# Altium schematic sheet Decimal Display Electronic Scheme_2021-10-08.schdoc
size 402 x 191 mm
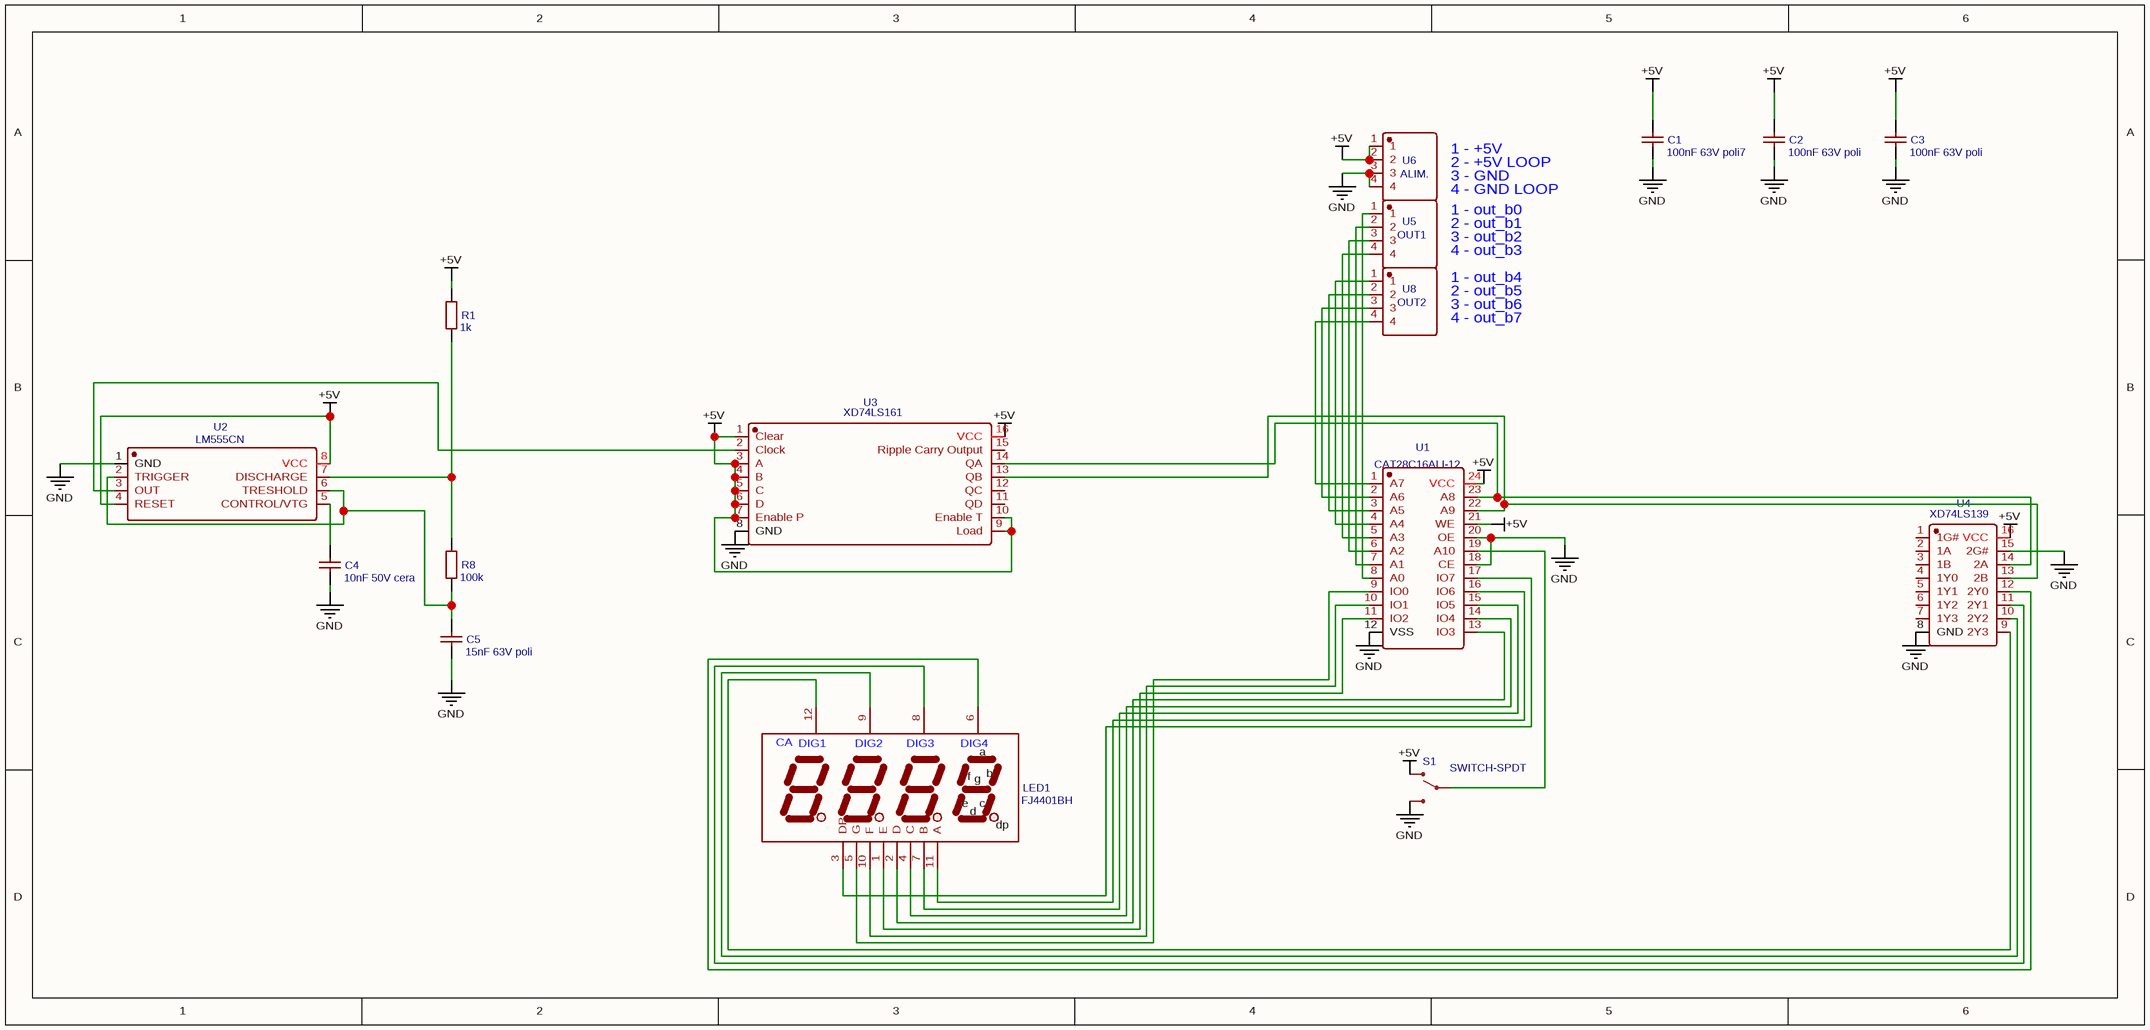
[diagram p0: Decimal Display Electronic Scheme_2021-10-08.schdoc]

## Parts
C1  100nF 63V poli7  [CAP-TH_L7.6-W3.8-P5.08-D0.51]
C2  100nF 63V poli  [CAP-TH_L7.6-W3.8-P5.08-D0.51]
C3  100nF 63V poli  [CAP-TH_L7.6-W3.8-P5.08-D0.51]
C4  10nF 50V cera  [CAP-TH_L7.6-W3.8-P5.08-D0.51]
C5  15nF 63V poli  [CAP-TH_L7.6-W3.8-P5.08-D0.51]
LED1  FJ4401BH  [LED-SEG-TH_12P-L40.4-W16.0-P2.54-S12.70-BL]
R1  1k  [RES-TH_BD3.0-L9.5-P13.50-D0.6]
R8  100k  [RES-TH_BD3.0-L9.5-P13.50-D0.6]
S1  SWITCH-SPDT  [SWITCH-SPDT-SMD]
U1  CAT28C16ALI-12  [DIP24-600]
U2  LM555CN  [DIP-8_L9.7-W6.4-P2.54-LS7.6-BL]
U3  XD74LS161  [DIP-16_L19.2-W6.6-P2.54-LS7.6-BL]
U4  XD74LS139  [DIP-16_L19.2-W6.6-P2.54-LS7.6-BL]
U5  OUT1  [HDR-TH_4P-P2.54-D1.0]
U6  ALIM.  [HDR-TH_4P-P2.54-D1.0]
U8  OUT2  [HDR-TH_4P-P2.54-D1.0]

## Nets
+5V: C1.1 C2.1 C3.1 R1.1 S1.1(O) U1.21(WE) U1.24(VCC) U2.4(RESET) U2.8(VCC) U3.1(Clear) U3.3(A) U3.4(B) U3.5(C) U3.6(D) U3.7(Enable_P) U3.9(Load) U3.10(Enable_T) U3.16(VCC) U4.16(VCC) U6.1 U6.2
GND: C1.2 C2.2 C3.2 C4.2 C5.2 S1.3(S) U1.12(VSS) U1.18(CE) U1.20(OE) U2.1(GND) U3.8(GND) U4.8(GND) U4.15(2G#) U6.3 U6.4
NetC4_1: C4.1 U2.5(CONTROL/VTG)
NetC5_1: C5.1 R8.2 U2.2(TRIGGER) U2.6(TRESHOLD)
NetLED1_1: LED1.1(E) U1.11(IO2)
NetLED1_2: LED1.2(D) U1.13(IO3)
NetLED1_3: LED1.3(DP) U1.17(IO7)
NetLED1_4: LED1.4(C) U1.14(IO4)
NetLED1_5: LED1.5(G) U1.9(IO0)
NetLED1_6: LED1.6(DIG4) U4.12(2Y0)
NetLED1_7: LED1.7(B) U1.15(IO5)
NetLED1_8: LED1.8(DIG3) U4.11(2Y1)
NetLED1_9: LED1.9(DIG2) U4.10(2Y2)
NetLED1_10: LED1.10(F) U1.10(IO1)
NetLED1_11: LED1.11(A) U1.16(IO6)
NetLED1_12: LED1.12(DIG1) U4.9(2Y3)
NetR1_2: R1.2 R8.1 U2.7(DISCHARGE)
NetS1_2: S1.2(P) U1.19(A10)
NetU1_1: U1.1(A7) U8.4
NetU1_2: U1.2(A6) U8.3
NetU1_3: U1.3(A5) U8.2
NetU1_4: U1.4(A4) U8.1
NetU1_5: U1.5(A3) U5.4
NetU1_6: U1.6(A2) U5.3
NetU1_7: U1.7(A1) U5.2
NetU1_8: U1.8(A0) U5.1
NetU1_22: U1.22(A9) U3.13(QB) U4.13(2B)
NetU1_23: U1.23(A8) U3.14(QA) U4.14(2A)
NetU2_3: U2.3(OUT) U3.2(Clock)

Not connected (* = marked no-connect by the designer): U3 11(QD) 12(QC) 15(Ripple_Carry_Output); U4 1(1G#) 2(1A) 3(1B) 4(1Y0) 5(1Y1) 6(1Y2) 7(1Y3)

## Notes on the sheet
- 1 - +5V
- 2 - +5V LOOP
- 3 - out_b2
- 1 - out_b0
- 2 - out_b1
- 3 - GND
- 4 - GND LOOP
- 2 - out_b5
- 1 - out_b4
- 3 - out_b6
- 4 - out_b3
- 4 - out_b7
- (in symbol FJ4401BH) CA; a; f; b; g; e; c; d; dp

## Library data of the parts
C1 = 100nF 63V poli7: BOM_Manufacturer: AVX; BOM_Manufacturer Part: SR305C105KAR; nameAlias: Capacitance; Contributor: LCSC; BOM_Supplier: LCSC; BOM_Supplier Part: C444741; BOM_JLCPCB Part Class: Extended Part; spicePre: C; spiceSymbolName: SR305C105KAR
C2 C3 = 100nF 63V poli: BOM_Manufacturer: AVX; BOM_Manufacturer Part: SR305C105KAR; nameAlias: Capacitance; Contributor: LCSC; BOM_Supplier: LCSC; BOM_Supplier Part: C444741; BOM_JLCPCB Part Class: Extended Part; spicePre: C; spiceSymbolName: SR305C105KAR
C4 = 10nF 50V cera: BOM_Manufacturer: AVX; BOM_Manufacturer Part: SR305C105KAR; nameAlias: Capacitance; Contributor: LCSC; BOM_Supplier: LCSC; BOM_Supplier Part: C444741; BOM_JLCPCB Part Class: Extended Part; spicePre: C; spiceSymbolName: SR305C105KAR
C5 = 15nF 63V poli: BOM_Manufacturer: AVX; BOM_Manufacturer Part: SR305C105KAR; nameAlias: Capacitance; Contributor: LCSC; BOM_Supplier: LCSC; BOM_Supplier Part: C444741; BOM_JLCPCB Part Class: Extended Part; spicePre: C; spiceSymbolName: SR305C105KAR
LED1 = FJ4401BH: BOM_Manufacturer: ReliaPro; BOM_Supplier: LCSC; BOM_Manufacturer Part: FJ4401BH; BOM_Supplier Part: C10712; BOM_JLCPCB Part Class: Extended Part; spicePre: L; spiceSymbolName: FJ4401BH
R1 = 1k: BOM_Manufacturer Part: CFR02SJ0823A10; BOM_Manufacturer: UniOhm; nameAlias: Resistance (Ohms); BOM_Supplier: LCSC; BOM_Supplier Part: C69876; spicePre: R; spiceSymbolName: CFR02SJ0823A10
R8 = 100k: BOM_Manufacturer Part: CFR02SJ0823A10; BOM_Manufacturer: UniOhm; nameAlias: Resistance (Ohms); BOM_Supplier: LCSC; BOM_Supplier Part: C69876; spicePre: R; spiceSymbolName: CFR02SJ0823A10
S1 = SWITCH-SPDT: Contributor: SparkFun; spicePre: S; spiceSymbolName: SWITCH-SPDT
U2 = LM555CN: BOM_Manufacturer: FAIRCHILD; BOM_Supplier: LCSC; BOM_Manufacturer Part: LM555CN; BOM_Supplier Part: C110322; spicePre: U; spiceSymbolName: LM555CN
U3 = XD74LS161: BOM_Manufacturer: XINLUDA; Contributor: LCSC; BOM_Supplier: LCSC; BOM_Supplier Part: C609766; BOM_Manufacturer Part: XD74LS161; BOM_JLCPCB Part Class: Extended Part; spicePre: U; spiceSymbolName: XD74LS161
U4 = XD74LS139: BOM_Manufacturer: XINLUDA; Contributor: LCSC; BOM_Supplier: LCSC; BOM_Supplier Part: C521175; BOM_Manufacturer Part: XD74LS139; BOM_JLCPCB Part Class: Extended Part; spicePre: U; spiceSymbolName: XD74LS139
U5 = OUT1: BOM_Manufacturer: TE Connectivity; BOM_Manufacturer Part: 171825-4; Contributor: LCSC; BOM_Supplier: LCSC; BOM_Supplier Part: C210162; BOM_JLCPCB Part Class: Extended Part; spicePre: U; spiceSymbolName: 171825-4
U6 = ALIM.: BOM_Manufacturer: TE Connectivity; BOM_Manufacturer Part: 171825-4; Contributor: LCSC; BOM_Supplier: LCSC; BOM_Supplier Part: C210162; BOM_JLCPCB Part Class: Extended Part; spicePre: U; spiceSymbolName: 171825-4
U8 = OUT2: BOM_Manufacturer: TE Connectivity; BOM_Manufacturer Part: 171825-4; Contributor: LCSC; BOM_Supplier: LCSC; BOM_Supplier Part: C210162; BOM_JLCPCB Part Class: Extended Part; spicePre: U; spiceSymbolName: 171825-4
U1 = CAT28C16ALI-12: spicePre: X; spiceSymbolName: CAT28C16ALI-12